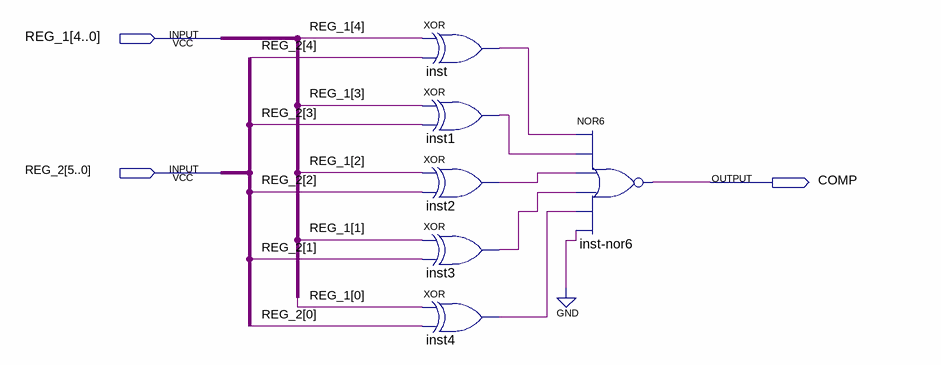
[diagram p0: schematic sheet]
// Quartus schematic Reg_Comp.bdf as structural Verilog: 6 symbols, 3 pins
module Reg_Comp (
  input  [4:0] REG_1,
  input  [5:0] REG_2,
  output COMP
);

  wire inst1_out, inst2_out, inst3_out, inst4_out, inst_out;

  xor inst (inst_out, REG_1[4], REG_2[4]);
  xor inst1 (inst1_out, REG_1[3], REG_2[3]);
  xor inst2 (inst2_out, REG_1[2], REG_2[2]);
  xor inst3 (inst3_out, REG_1[1], REG_2[1]);
  xor inst4 (inst4_out, REG_1[0], REG_2[0]);
  nor \inst-nor6  (COMP, inst_out, inst1_out, inst2_out, inst3_out, inst4_out, 1'b0);
endmodule
